# EAGLE design STM32F446RE_subcircuit (EAGLE 8.6.3)
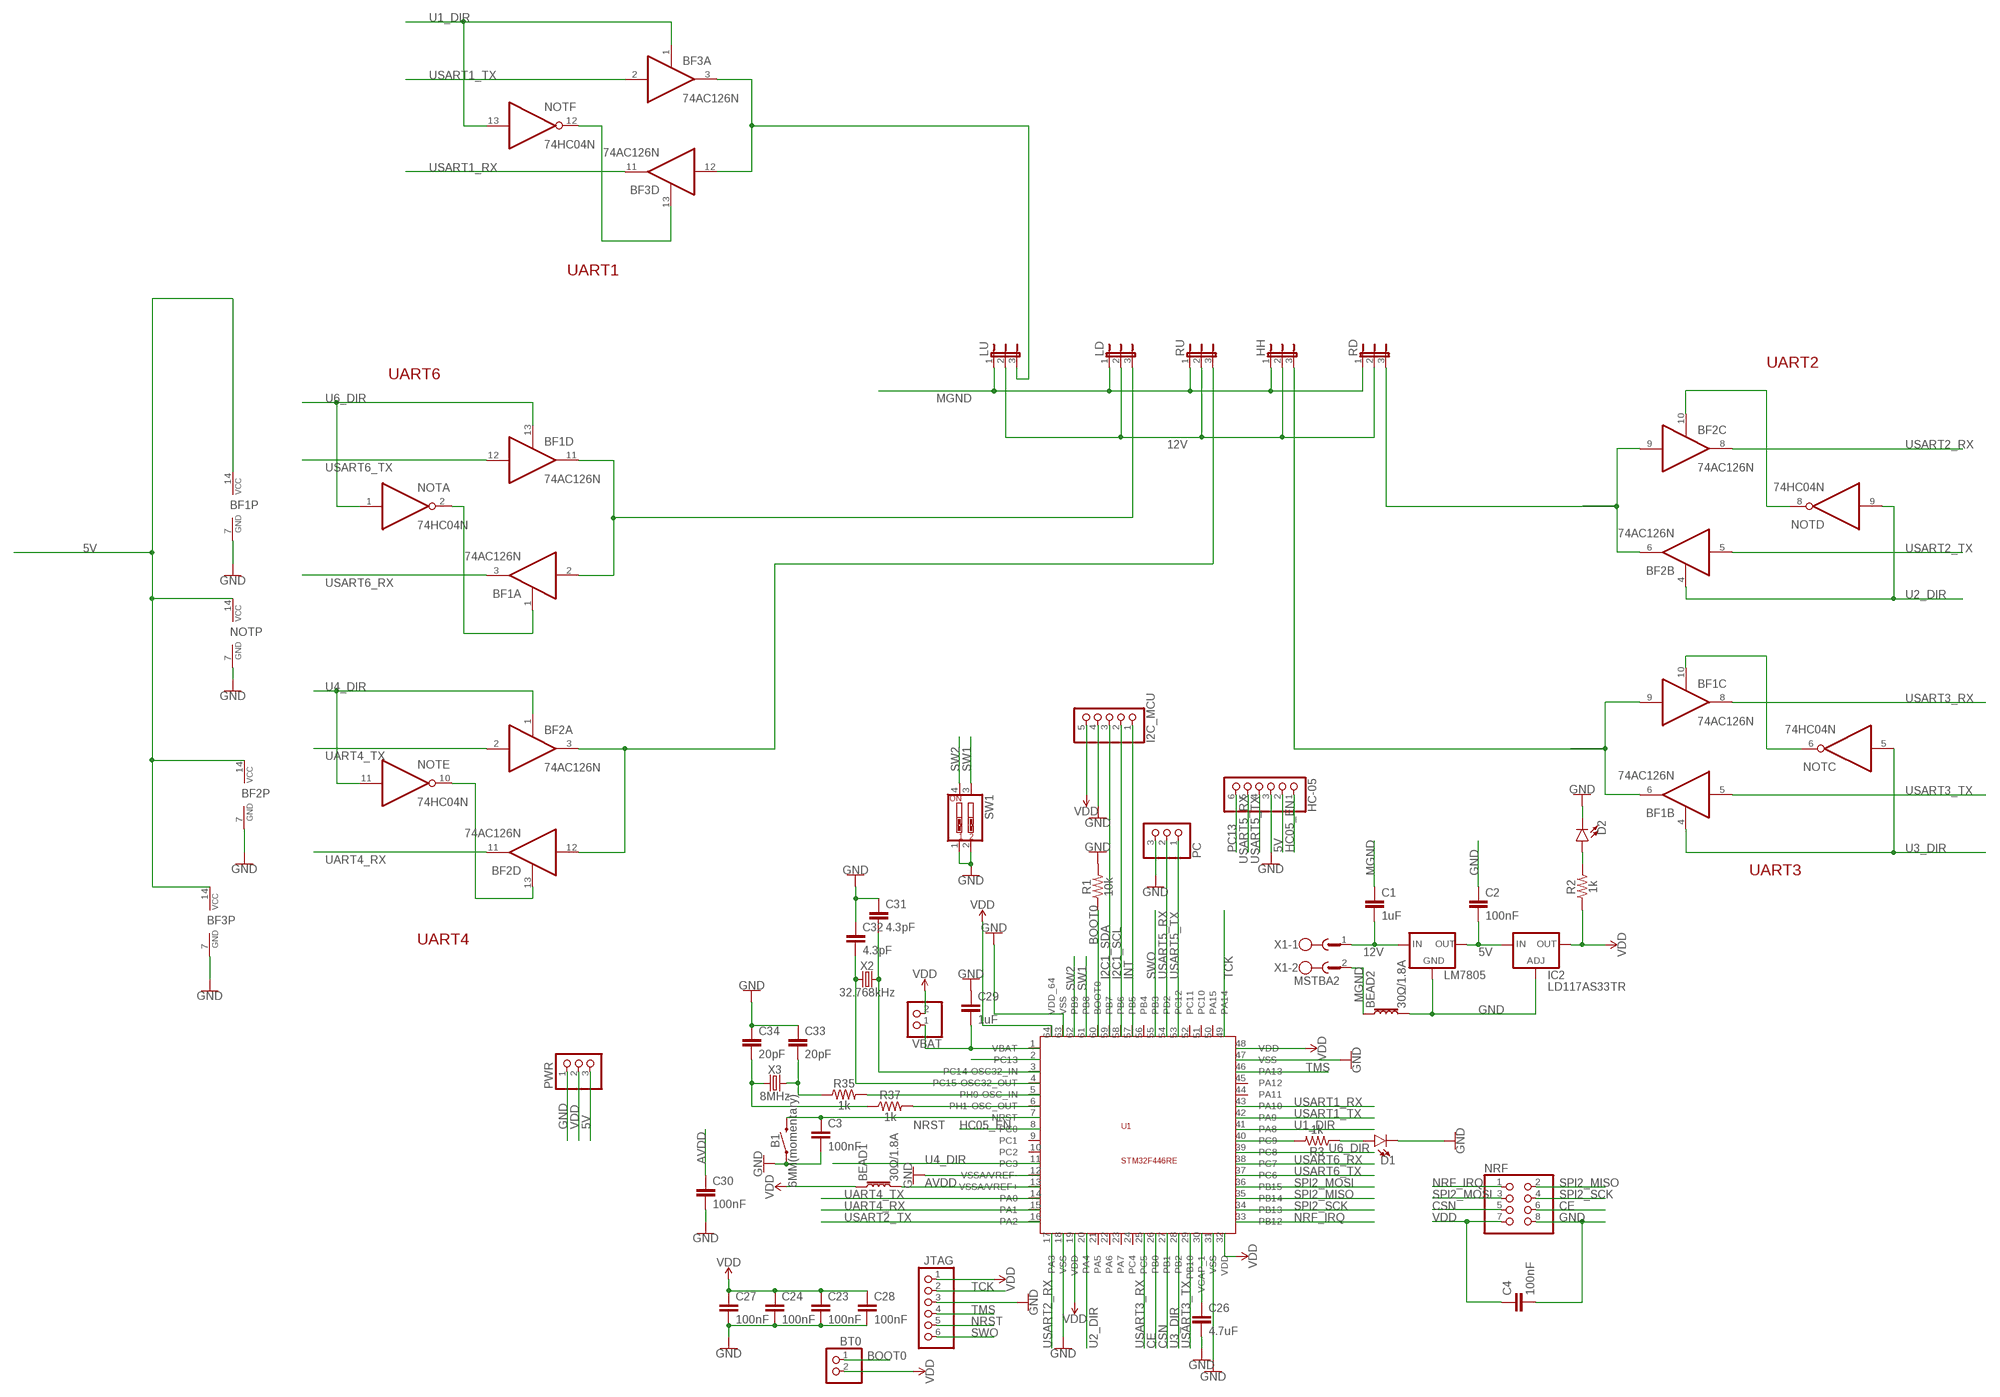
[diagram p0: schematic, sheet 1]

## Parts
B1  6MM(momentary)  MOMENTARY-SWITCH-SPST-PTH-6.0MM  [TACTILE_SWITCH_PTH_6.0MM]
BEAD1  30Ω/1.8A  FERRITE_BEAD-0603  [0603]
BEAD2  30Ω/1.8A  FERRITE_BEAD-0603  [0603]
BF1  74AC126N  [DIL14]
BF2  74AC126N  [DIL14]
BF3  74AC126N  [DIL14]
BT0  PINHD-1X2  [1X02]
C1  1uF  C5P  [C050-030-075]
C2  100nF  C2.5P  [C025-030X050]
C3  100nF  C2.5P  [C025-030X050]
C4  100nF  C2.5P  [C025-030X050]
C23  100nF  C2.5P  [C025-030X050]
C24  100nF  C2.5P  [C025-030X050]
C26  4.7uF  C5P  [C050-030-075]
C27  100nF  C2.5P  [C025-030X050]
C28  100nF  C2.5P  [C025-030X050]
C29  1uF  C5P  [C050-030-075]
C30  100nF  C2.5P  [C025-030X050]
C31  4.3pF  C2.5P  [C025-030X050]
C32  4.3pF  C2.5P  [C025-030X050]
C33  20pF  C2.5P  [C025-030X050]
C34  20pF  C2.5P  [C025-030X050]
D1  LED5MM  [LED_5MM]
D2  LED5MM  [LED_5MM]
HC-05  PINHD-1X6  [1X06]
HH  JP2E  [JP2]
I2C_MCU  PINHD-1X5  [1X05]
IC2  LD117AS33TR  [SOT223]
JTAG  PINHD-1X6  [1X06]
LD  JP2E  [JP2]
LM7805  V_REG_78XX-TO-220  [TO-220-ALT]
LU  JP2E  [JP2]
NOT  74HC04N  [DIL14]
NRF  PINHD-2X4  [2X04]
PC  PINHD-1X3  [1X03]
PWR  PINHD-1X3  [1X03]
R1  10k  10KOHM-HORIZ-1/4W-1%  [AXIAL-0.3]
R2  1k  1KOHM-HORIZ-1/4W-1%  [AXIAL-0.3]
R3  1k  1KOHM-HORIZ-1/4W-5%  [AXIAL-0.3]
R35  1k  10KOHM-HORIZ-1/4W-1%  [AXIAL-0.3]
R37  1k  10KOHM-HORIZ-1/4W-1%  [AXIAL-0.3]
RD  JP2E  [JP2]
RU  JP2E  [JP2]
SW1  SW_DIP-2  [EDG-02]
U1  STM32F446RE  [QFP50P1200X1200X160-64N]
VBAT  PINHD-1X2  [1X02]
X1  MSTBA2  [MSTBA2]
X2  32.768kHz  CRYSTAL-32.768KHZPTH-2X6  [CRYSTAL-PTH-2X6-CYL]
X3  8MHz  CRYSTAL-8MHZSMD-HC49UP  [HC49UP]

## Nets
5V: BF1.14(P:VCC) BF2.14(P:VCC) BF3.14(P:VCC) C2.2 HC-05.2 IC2.3(IN) LM7805.OUT NOT.14(P:VCC) PWR.3
12V: C1.2 HH.2 LD.2 LM7805.IN LU.2 RD.2 RU.2 X1.1
AVDD: BEAD1.2 C30.1 U1.13(VSSA/VREF+)
BOOT0: BT0.1 R1.P$1 U1.60(BOOT0)
CE: NRF.6 U1.26(PB0)
CSN: NRF.5 U1.27(PB1)
GND: B1.1 BEAD2.2 BF1.7(P:GND) BF2.7(P:GND) BF3.7(P:GND) C2.1 C3.2 C4.2 C23.2 C24.2 C26.2 C27.2 C28.2 C29.1 C30.2 C31.1 C32.1 C33.1 C34.1 D1.K(C) D2.K(C) HC-05.3 I2C_MCU.4 IC2.1(ADJ) JTAG.3 LM7805.GND NOT.7(P:GND) NRF.8 PC.3 PWR.1 R1.P$2 SW1.1 SW1.2 U1.12(VSSA/VREF-) U1.18(VSS) U1.31(VSS) U1.47(VSS) U1.63(VSS)
HC05_EN: HC-05.1 U1.8(PC0)
I2C1_SCL: I2C_MCU.2 U1.58(PB6)
I2C1_SDA: I2C_MCU.3 U1.59(PB7)
INT: I2C_MCU.1 U1.57(PB5)
MGND: BEAD2.1 C1.1 HH.1 LD.1 LU.1 RD.1 RU.1 X1.2
N$1: R35.P$2 U1.5(PH0-OSC_IN)
N$2: R37.P$2 U1.6(PH1-OSC_OUT)
N$3: BF1.1(A:OE) NOT.2(A:O)
N$4: C34.2 R37.P$1 X3.1
N$5: C33.2 R35.P$1 X3.2
N$6: BF1.10(C:OE) NOT.6(C:O)
N$7: D2.A R2.P$2
N$8: C31.2 U1.3(PC14-OSC32_IN) X2.2
N$9: C32.2 U1.4(PC15-OSC32_OUT) X2.1
N$10: R3.P$2 U1.40(PC9)
N$11: BF2.13(D:OE) NOT.10(E:O)
N$12: D1.A R3.P$1
N$17: BF2.10(C:OE) NOT.8(D:O)
N$18: BF3.13(D:OE) NOT.12(F:O)
N$20: BF3.3(A:O) BF3.12(D:I) LU.3
NRF_IRQ: NRF.1 U1.33(PB12)
NRST: B1.3 C3.1 JTAG.5 U1.7(NRST)
OUT1: BF1.2(A:I) BF1.11(D:O) LD.3
OUT2: BF2.3(A:O) BF2.12(D:I) RU.3
OUT3: BF1.6(B:O) BF1.9(C:I) HH.3
OUT4: BF2.6(B:O) BF2.9(C:I) RD.3
PC13: HC-05.6 U1.2(PC13)
SPI2_MISO: NRF.2 U1.35(PB14)
SPI2_MOSI: NRF.3 U1.36(PB15)
SPI2_SCK: NRF.4 U1.34(PB13)
SW1: SW1.3 U1.61(PB8)
SW2: SW1.4 U1.62(PB9)
SWO: JTAG.6 U1.55(PB3)
TCK: JTAG.2 U1.49(PA14)
TMS: JTAG.4 U1.46(PA13)
U1_DIR: BF3.1(A:OE) NOT.13(F:I) U1.41(PA8)
U2_DIR: BF2.4(B:OE) NOT.9(D:I) U1.20(PA4)
U3_DIR: BF1.4(B:OE) NOT.5(C:I) U1.28(PB2)
U4_DIR: BF2.1(A:OE) NOT.11(E:I) U1.11(PC3)
U6_DIR: BF1.13(D:OE) NOT.1(A:I) U1.39(PC8)
UART4_RX: BF2.11(D:O) U1.15(PA1)
UART4_TX: BF2.2(A:I) U1.14(PA0)
USART1_RX: BF3.11(D:O) U1.43(PA10)
USART1_TX: BF3.2(A:I) U1.42(PA9)
USART2_RX: BF2.8(C:O) U1.17(PA3)
USART2_TX: BF2.5(B:I) U1.16(PA2)
USART3_RX: BF1.8(C:O) U1.25(PC5)
USART3_TX: BF1.5(B:I) U1.29(PB10)
USART5_RX: HC-05.5 PC.2 U1.54(PD2)
USART5_TX: HC-05.4 PC.1 U1.53(PC12)
USART6_RX: BF1.3(A:O) U1.38(PC7)
USART6_TX: BF1.12(D:I) U1.37(PC6)
VBAT: C29.2 U1.1(VBAT) VBAT.1
VCAP_1: C26.1 U1.30(VCAP_1)
VDD: BEAD1.1 BT0.2 C4.1 C23.1 C24.1 C27.1 C28.1 I2C_MCU.5 IC2.4(OUT) JTAG.1 NRF.7 PWR.2 R2.P$1 U1.19(VDD) U1.32(VDD) U1.48(VDD) U1.64(VDD_64) VBAT.2
Unconnected: BF3.4(B:OE) BF3.5(B:I) BF3.6(B:O) BF3.8(C:O) BF3.9(C:I) BF3.10(C:OE) NOT.3(B:I) NOT.4(B:O) U1.9(PC1) U1.10(PC2) U1.21(PA5) U1.22(PA6) U1.23(PA7) U1.24(PC4) U1.44(PA11) U1.45(PA12) U1.50(PA15) U1.51(PC10) U1.52(PC11) U1.56(PB4)

## Notes on the sheet
- UART1
- UART6 | UART2
- UART3
- UART4

## Library data of the parts
B1 = SparkFun-Switches:MOMENTARY-SWITCH-SPST: Momentary Switch (Pushbutton) - SPST Normally-open (NO) SPST momentary switches (buttons, pushbuttons). Variants PTH-12MM - 12mm square, through-hole Momentary Pushbutton Switch - 12mm Square <https://www.sparkfun.com/products/9190> (COM-09190) PTH-6.0MM, PTH-6.0MM-KIT - 6.0mm square, through-hole Mini Pushbutton Switch <https://www.sparkfun.com/products/97> (COM-00097) KIT package intended for soldering kit's - only one side of pads' copper is exposed. PTH-RIGHT-ANGLE-KIT - Right-angle, through-hole Right Angle Tactile Button <https://www.sparkfun.com/products/10791> - Used on SparkFun BigTime Watch Kit <https://www.sparkfun.com/products/11734> SMD-12MM - 12mm square, surface-mount Tactile Button - SMD (12mm) <https://www.sparkfun.com/products/12993> (COM-12993) Used on SparkFun PicoBoard <https://www.sparkfun.com/products/11888> SMD-4.5MM - 4.5mm Square Trackball Switch Used on SparkFun Blackberry Trackballer Breakout <https://www.sparkfun.com/products/13169> SMD-4.6MMX2.8MM - 4.60mm x 2.80mm, surface mount Used on SparkFun SAMD21 Mini Breakout <https://www.sparkfun.com/products/13664> SMD-5.2MM, SMD-5.2-REDUNDANT - 5.2mm square, surface-mount Mini Pushbutton Switch - SMD <https://www.sparkfun.com/products/8720> (COM-08720) Used on Arduino Pro Mini <https://www.sparkfun.com/products/11114> REDUNDANT package connects both switch circuits together SMD-6.0X3.5MM - 6.0 x 3.5mm, surface mount Momentary Reset Switch SMD <https://www.sparkfun.com/products/8229> (COM-08229) SMD-6.2MM-TALL - 6.2mm square, surface mount Tactile Button - SMD (6mm) <https://www.sparkfun.com/products/12992> Used on SparkFun Digital Sandbox <https://www.sparkfun.com/products/12651> SMD-RIGHT-ANGLE - Right-angle, surface mount Used on SparkFun Block for Intel® Edison - Arduino <https://www.sparkfun.com/products/13036>; PROD_ID: SWCH-08441; SF_SKU: COM-00097
BEAD1 BEAD2 = SparkFun-Coils:FERRITE_BEAD: Ferrite Bead (blocks, cores, rings, chokes, etc.) Inductor with layers of ferrite used to suppress high frequencies. Often used to isolate high frequency noise. SparkFun Products: IOIO-OTG - V2.2 <https://www.sparkfun.com/products/13613> SparkFun SAMD21 Mini Breakout <https://www.sparkfun.com/products/13664> SparkFun 6 Degrees of Freedom Breakout - LSM6DS3 <https://www.sparkfun.com/products/13339> SparkFun SAMD21 Dev Breakout <https://www.sparkfun.com/products/13672>; PROD_ID: NDUC-13805
BF1-BF3 = 74xx-eu:74*126: Quad bus BUFFER, 3-state
BT0 VBAT = pinhead:PINHD-1X2: PIN HEADER
C1-C4 C23 C24 C26-C34 = ee2parts:C: Capacitor
D1 D2 = SparkFun-LED:LED: LED (Generic) Standard schematic elements and footprints for 5mm, 3mm, 1206, and 0603 sized LEDs. Generic LEDs with no color specified.
HC-05 JTAG = pinhead:PINHD-1X6: PIN HEADER
HH LD LU RD RU = jumper:JP2E: JUMPER
I2C_MCU = pinhead:PINHD-1X5: PIN HEADER
IC2 = v-reg:LD117A?*: Low drop fixed and adjustable positive voltage regulators 1 A Source: http://www.st.com/stonline/products/literature/ds/7194/ld1117axx.pdf
LM7805 = SparkFun-IC-Power:V_REG_78XX: Voltage Regulator Standard 78xx regulator. IGO (Input Ground Output). Spark Fun Electronics SKU : COM-00107; PROD_ID: VREG-08450; SF_ID: COM-00107
NOT = 74xx-eu:74*04: Hex INVERTER
NRF = pinhead:PINHD-2X4: PIN HEADER
PC PWR = pinhead:PINHD-1X3: PIN HEADER
R1 = SparkFun-Resistors:10KOHM: 10kΩ resistor A resistor is a passive two-terminal electrical component that implements electrical resistance as a circuit element. Resistors act to reduce current flow, and, at the same time, act to lower voltage levels within circuits. - Wikipedia; PROD_ID: RES-12183
R2 = SparkFun-Resistors:1KOHM: 1kΩ resistor A resistor is a passive two-terminal electrical component that implements electrical resistance as a circuit element. Resistors act to reduce current flow, and, at the same time, act to lower voltage levels within circuits. - Wikipedia; PROD_ID: RES-12182
R3 = SparkFun-Resistors:1KOHM: 1kΩ resistor A resistor is a passive two-terminal electrical component that implements electrical resistance as a circuit element. Resistors act to reduce current flow, and, at the same time, act to lower voltage levels within circuits. - Wikipedia; PROD_ID: RES-08380
R35 R37 = SparkFun-Resistors:10KOHM: 10kΩ resistor A resistor is a passive two-terminal electrical component that implements electrical resistance as a circuit element. Resistors act to reduce current flow, and, at the same time, act to lower voltage levels within circuits. - Wikipedia; PROD_ID: RES-12183; VALUE: 10k
SW1 = special:SW_DIP-2: DIP SWITCH
U1 = STM32F446RE:STM32F446RE
X1 = con-phoenix-508:MSTBA2: PHOENIX; MF: FARNELL; MPN: 1757242; OC_FARNELL: 3705171; OC_NEWARK: 71C4161
X2 = SparkFun-Clocks:CRYSTAL-32.768KHZ: 32.768kHz Crystal Frequency: 32.768kHz Frequency Stability: ±20ppm Load Capacitance: 12.5pF (PTH-2X6 & SMD-3.2X1.5), 6pF (SMD-2X6) SparkFun Products: SparkFun BigTime Watch Kit <https://www.sparkfun.com/products/11734> SparkFun nRF52832 Breakout <https://www.sparkfun.com/products/13990> SparkFun Real Time Clock Module <https://www.sparkfun.com/products/12708>; PROD_ID: XTAL-10112
X3 = SparkFun-Clocks:CRYSTAL-8MHZ: 8MHz Crystal Datasheet Example <http://www.futureelectronics.com/en/technologies/electromechanical/timing-devices/crystals/Pages/6008189-ABM3B-8.000MHZ-B2-T.aspx?IM=0> Frequency: 8MHz Frequency Tolerance: ±20ppm Load Capacitance: 18pF SparkFun Products: Pro Micro -3.3V/8MHz <https://www.sparkfun.com/products/12587> WAV Trigger <https://www.sparkfun.com/products/13660>; PROD_ID: XTAL-11706

## Net classes
0 default: width 0.178 mm, drill 0.178 mm, clearance 0.178 mm

## Board
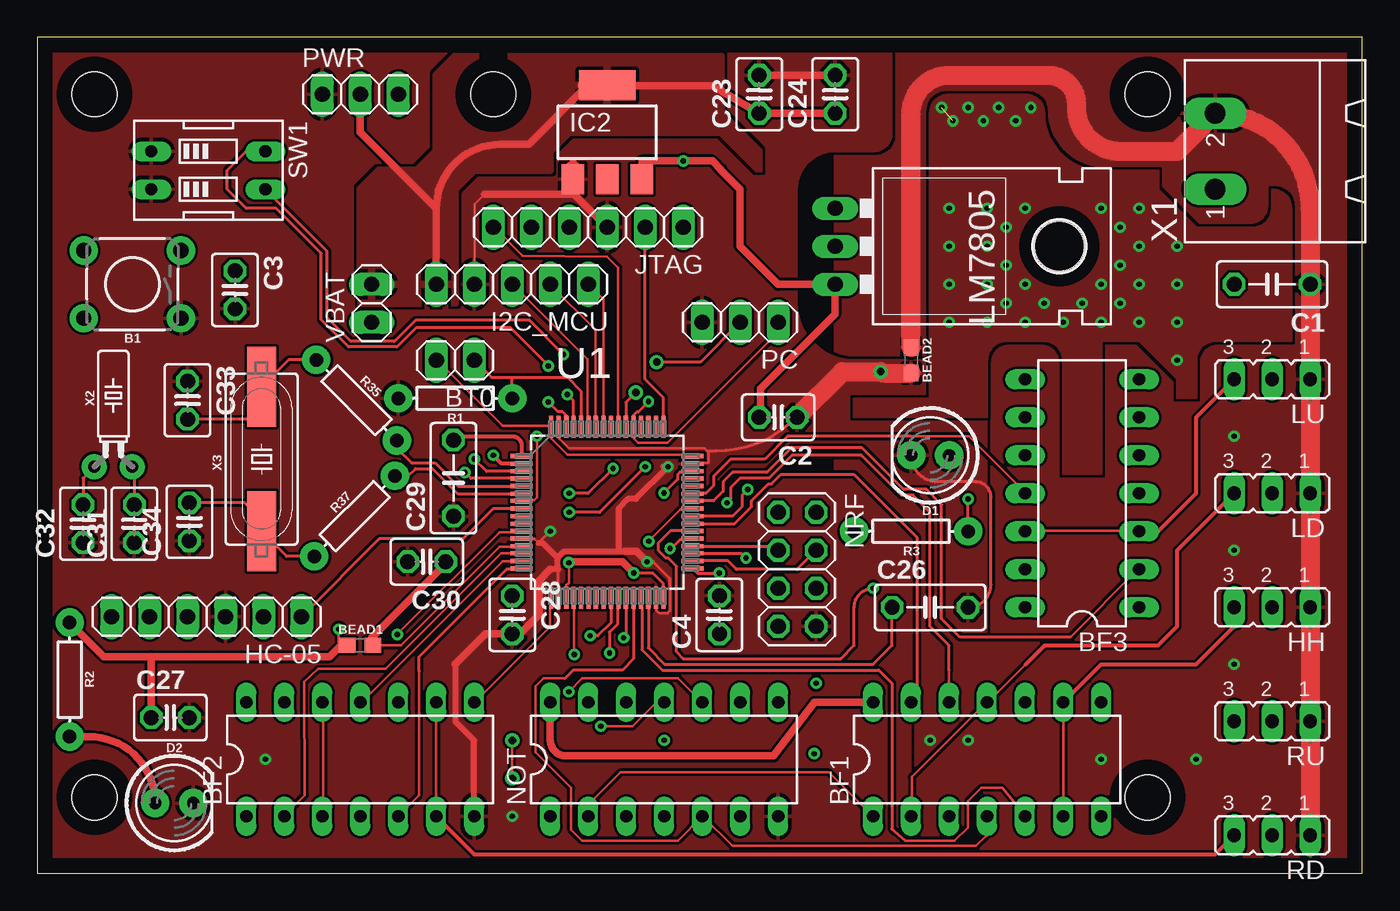
[diagram p1: board, top side]
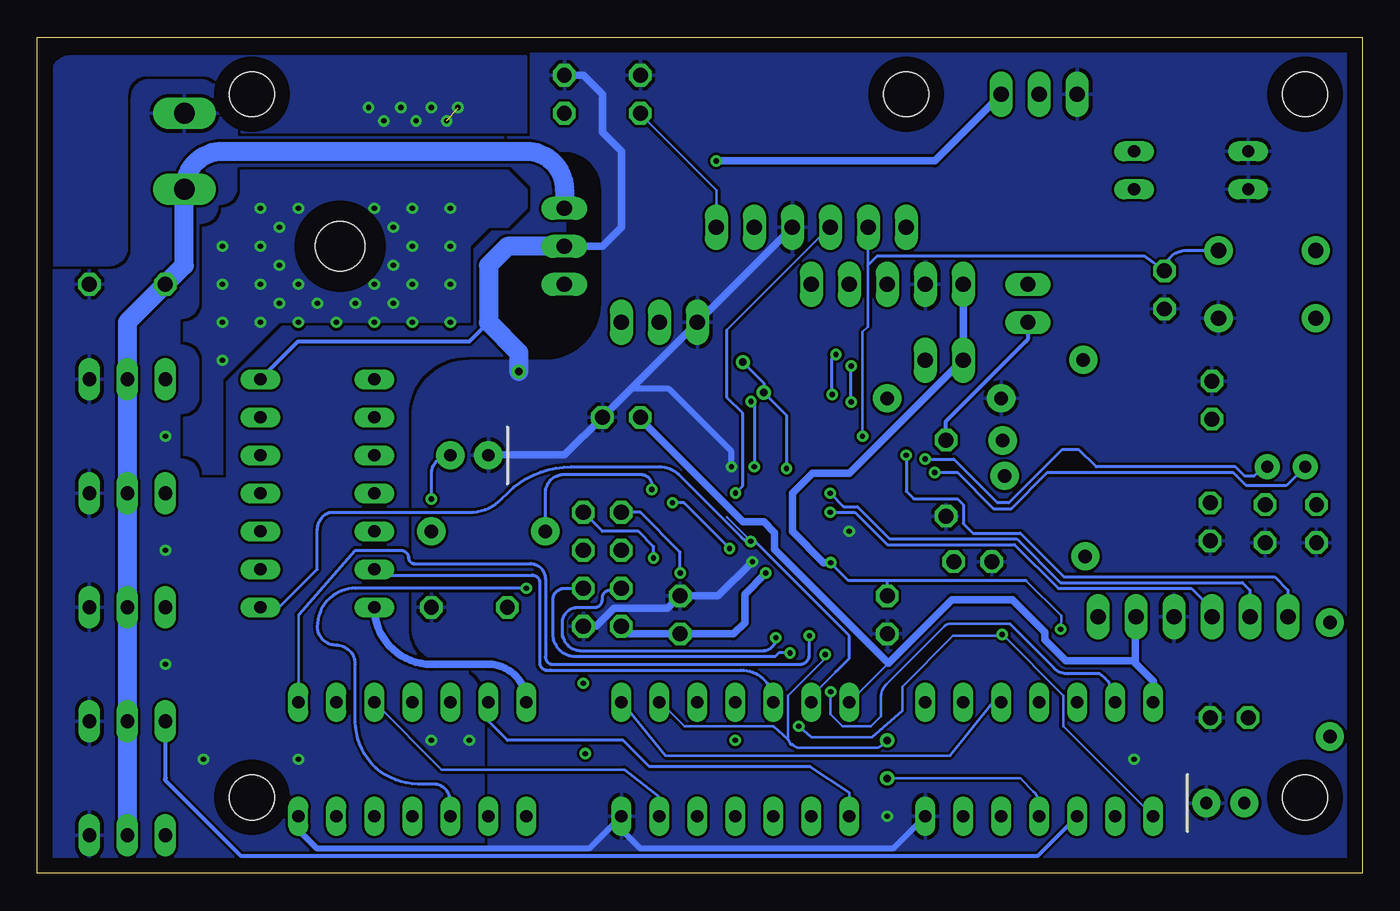
[diagram p2: board, bottom side, seen from below]

Size 88.57 x 55.87 mm. Coordinates in mm from the lower left corner, seen from the top.
Outline: 0,0 88.57,0 88.57,55.87 0,55.87 0,0
Copper layers (1*16): Top 0.035mm / dielectric 1.5mm / Bottom 0.035mm
Design rules "default *": minimum track width 1mil, minimum drill 0.35mm, track to track 6mil, track to pad 6mil, pad to pad 6mil, via to via 6mil, smd to smd 6mil, copper to edge 40mil, drill to drill 6mil, minimum pad ring 10mil, minimum via ring 8mil, stop-mask expansion 4mil, vias tented up to drill 0mil, thermal gap 10mil
Holes 3 mm at 74.23,5.08 3.81,5.08 3.81,52.07 74.23,52.07 30.48,52.07

### Footprints (pad centres in the part's own frame; a part is rotated, then mirrored left to right if it is on the bottom)
TACTILE_SWITCH_PTH_6.0MM = drill 1.016 pad 1.88: 1 -3.251,2.261; 2 3.251,2.261; 3 -3.251,-2.261; 4 3.251,-2.261
0603 = smd 1.1 x 1: 1 -0.85,0; 2 0.85,0
DIL14 = drill 0.813 long: 1 -7.62,-3.81; 2 -5.08,-3.81; 3 -2.54,-3.81; 4 0,-3.81; 5 2.54,-3.81; 6 5.08,-3.81; 7 7.62,-3.81; 8 7.62,3.81; 9 5.08,3.81; 10 2.54,3.81; 11 0,3.81; 12 -2.54,3.81; 13 -5.08,3.81; 14 -7.62,3.81
1X02 = drill 1.016 long: 1 -1.27,0; 2 1.27,0
C050-030-075 = drill 1 octagon: 1 -2.54,0; 2 2.54,0
C025-030X050 = drill 1 octagon: 1 -1.27,0; 2 1.27,0
LED_5MM = drill 0.813 pad 1.88: A -1.27,0; K 1.27,0
1X06 = drill 1.016 long: 1 -6.35,0; 2 -3.81,0; 3 -1.27,0; 4 1.27,0; 5 3.81,0; 6 6.35,0
JP2 = drill 0.914 long: 1 -2.54,0; 2 0,0; 3 2.54,0
1X05 = drill 1.016 long: 1 -5.08,0; 2 -2.54,0; 3 0,0; 4 2.54,0; 5 5.08,0
SOT223 = smd 1.5 x 2: 1 -2.3,-3.15; 2 0,-3.15; 3 2.3,-3.15 | smd 3.8 x 2: 4 0,3.15
TO-220-ALT = drill 1.016 long: GND 0,-3.81; IN -2.54,-3.81; OUT 2.54,-3.81 | hole 3.302: 0,11.176
2X04 = drill 1.016 octagon: 1 -3.81,-1.27; 2 -3.81,1.27; 3 -1.27,-1.27; 4 -1.27,1.27; 5 1.27,-1.27; 6 1.27,1.27; 7 3.81,-1.27; 8 3.81,1.27
1X03 = drill 1.016 long: 1 -2.54,0; 2 0,0; 3 2.54,0
AXIAL-0.3 = drill 0.9 pad 1.88: P$1 -3.81,0; P$2 3.81,0
EDG-02 = drill 0.813 long: 1 -1.27,-3.81; 2 1.27,-3.81; 3 1.27,3.81; 4 -1.27,3.81
QFP50P1200X1200X160-64N = smd 1.473 x 0.279: 1 -5.715,3.759; 2 -5.715,3.251; 3 -5.715,2.743; 4 -5.715,2.261; 5 -5.715,1.753; 6 -5.715,1.245; 7 -5.715,0.762; 8 -5.715,0.254; 9 -5.715,-0.254; 10 -5.715,-0.762; 11 -5.715,-1.245; 12 -5.715,-1.753; 13 -5.715,-2.261; 14 -5.715,-2.743; 15 -5.715,-3.251; 16 -5.715,-3.759; 33 5.715,-3.759; 34 5.715,-3.251; 35 5.715,-2.743; 36 5.715,-2.261; 37 5.715,-1.753; 38 5.715,-1.245; 39 5.715,-0.762; 40 5.715,-0.254; 41 5.715,0.254; 42 5.715,0.762; 43 5.715,1.245; 44 5.715,1.753; 45 5.715,2.261; 46 5.715,2.743; 47 5.715,3.251; 48 5.715,3.759 | smd 0.279 x 1.473: 17 -3.759,-5.715; 18 -3.251,-5.715; 19 -2.743,-5.715; 20 -2.261,-5.715; 21 -1.753,-5.715; 22 -1.245,-5.715; 23 -0.762,-5.715; 24 -0.254,-5.715; 25 0.254,-5.715; 26 0.762,-5.715; 27 1.245,-5.715; 28 1.753,-5.715; 29 2.261,-5.715; 30 2.743,-5.715; 31 3.251,-5.715; 32 3.759,-5.715; 49 3.759,5.715; 50 3.251,5.715; 51 2.743,5.715; 52 2.261,5.715; 53 1.753,5.715; 54 1.245,5.715; 55 0.762,5.715; 56 0.254,5.715; 57 -0.254,5.715; 58 -0.762,5.715; 59 -1.245,5.715; 60 -1.753,5.715; 61 -2.261,5.715; 62 -2.743,5.715; 63 -3.251,5.715; 64 -3.759,5.715
MSTBA2 = drill 1.397 long: 1 -2.54,5.08; 2 2.54,5.08
CRYSTAL-PTH-2X6-CYL = drill 0.813 pad 1.676: 1 -1.27,0; 2 1.27,0
HC49UP = smd 5.334 x 1.93: 1 -4.826,0; 2 4.826,0

### Placement (x,y rotation side)
B1  6.35,39.37 180 top
BEAD1  21.59,15.24 0 top
BEAD2  58.42,34.29 270 top
BF1  63.5,7.62 0 top
BF2  21.59,7.62 0 top
BF3  69.85,25.4 90 top
BT0  27.94,34.29 180 top
C1  82.55,39.37 180 top
C2  49.53,30.48 180 top
C3  13.21,38.99 270 top
C4  45.59,17.27 90 top
C23  48.26,52.07 90 top
C24  53.34,52.07 90 top
C26  59.69,17.78 0 top
C27  8.89,10.41 0 top
C28  31.75,17.27 270 top
C29  27.81,26.42 90 top
C30  26.04,20.83 180 top
C31  6.48,23.37 90 top
C32  3.05,23.37 90 top
C33  10.03,31.62 270 top
C34  10.16,23.49 90 top
D1  59.69,27.94 180 top
D2  9.14,4.7 0 top
HC-05  11.3,17.14 180 top
HH  82.55,17.78 180 top
I2C_MCU  31.75,39.37 180 top
IC2  38.1,49.53 0 top
JTAG  36.83,43.18 180 top
LD  82.55,25.4 180 top
LM7805  57.15,41.91 270 top
LU  82.55,33.02 180 top
NOT  41.91,7.62 0 top
NRF  50.8,20.32 270 top
PC  46.99,36.83 180 top
PWR  21.59,52.07 0 top
R1  27.94,31.75 180 top
R2  2.16,12.95 270 top
R3  58.42,22.86 180 top
R35  21.34,31.62 315 top
R37  21.21,23.88 45 top
RD  82.55,2.54 180 top
RU  82.55,10.16 180 top
SW1  11.43,46.99 270 top
U1  38.1,24.13 0 top
VBAT  22.35,38.1 90 top
X1  83.82,48.26 90 top
X2  5.08,27.18 0 top
X3  14.99,27.69 90 top

### Tracks (layer width: path | path; a pad name or v marks a point on that pad's centre or on a via)
5V  (via drill 0.35)
  Top 0.178: 53.31,39.43 LM7805.OUT 53.31,39.34 | 48.34,30.54 C2.2
  Top 0.508: 48.34,30.54 48.34,32.38 53.31,37.36 53.31,39.34 | BF1.14 51.94,11.43 49.22,7.85 35.33,7.85 arc-90 34.29,8.89 NOT.14 | LM7805.OUT 49.53,39.37 46.99,41.91 46.99,45.72 45.72,46.99 45.72,47.03 45.14,47.61 v43.18,47.61 40.42,47.61 IC2.3
  Bottom 0.178: 56.43,11.43 BF1.14 | 66.03,17.74 BF3.14 | 23.38,18.3 23.37,18.29 | NOT.14 31.67,14.05 | 48.07,30.45 48.25,30.45 C2.2
  Bottom 0.508: 23.38,18.3 27.42,18.3 31.67,14.05 39.29,21.67 39.29,22.78 40,23.49 41.4,23.49 48.25,30.34 48.25,30.45 | 15.18,14.03 15.37,14.22 19.81,14.22 21.21,15.62 21.21,16.13 23.37,18.29 | 15.18,14.03 13.97,12.83 BF2.14 | BF1.14 arc-90 58.42,13.97 62.23,13.97 arc90 BF3.14 | 15.18,14.03 15.18,17.08 HC-05.2 | PWR.3 28.57,47.62 43.17,47.62 v43.18,47.61
12V
  Top 0.254: 79.98,39.42 C1.2
  Bottom 0.254: 80.07,39.33 C1.2 | 82.47,33.02 LU.2
  Bottom 1.27: RD.2 RU.2 HH.2 LD.2 LU.2 82.55,36.83 C1.2 78.74,40.64 X1.1 arc90 76.2,48.26 55.88,48.26 arc90 53.34,45.72 LM7805.IN
AVDD
  Top 0.178: 22.2,15.25 22.38,15.25 BEAD1.2 22.47,15.25 24.33,15.25 30.91,21.83 32.33,21.83 U1.13
  Top 0.508: C30.1 27.3,20.7 22.35,15.75 22.38,15.72 22.38,15.25
BOOT0
  Top 0.178: 36.33,30.48 36.33,29.92 U1.60 | BT0.1 29.22,34.28
  Top 0.203: 29.21,35.18 BT0.1 30.35,33.15 31.75,33.15 | 36.32,30.49 36.33,30.48 | 31.75,33.15 35.43,33.15 36.35,32.23 U1.60 | R1.P$1 31.75,33.15
CE  (via drill 0.35)
  Top 0.203: U1.26 38.77,18.33 38.77,16.64 38.25,16.12 v38.25,14.73
  Bottom 0.203: v38.25,14.73 38.99,14.73 39.24,14.48 52.58,14.48 arc90 54.1,16 54.1,18.29 arc90 53.34,19.05 NRF.6
CSN  (via drill 0.35)
  Top 0.203: U1.27 39.34,15.9 arc-90 v39.2,15.75
  Bottom 0.203: v39.2,15.75 arc90 40.08,14.86 52.2,14.86 arc90 53.47,16.13 53.47,16.76 arc90 52.45,17.78 51.31,17.78 arc-90 50.8,18.29 50.8,18.41 arc90 50.29,18.92 49.66,18.92 arc-90 NRF.5
GND  (via drill 0.35, 0.5 pad 0.95)
  Top 0.178: 33.51,22.08 33.22,22.36 32.42,22.36 U1.12 | 34.82,20.32 34.82,18.45 U1.18 34.82,18.36 | 42.29,19.34 42.29,19.05 42.29,17.56 42.11,17.39 41.58,17.39 41.4,17.56 41.4,18.36 U1.31 | 35.8,45.48 35.85,45.43 35.8,45.39 | 29.91,45.39 29.22,44.7 29.22,39.43 I2C_MCU.4 29.13,39.34 | 58.47,27.88 D1.K | 50.82,30.54 C2.1 50.74,30.45 | U1.63 34.91,29.83 34.91,29.03 35.53,28.41 44.6,28.41 44.76,28.25 44.87,28.14 44.87,27.43 43.89,27.43 U1.47 43.8,27.43 | 48.34,53.39 C23.2 | 53.31,53.39 C24.2 53.4,53.39 | 53.4,41.57 53.4,41.83 LM7805.GND | 73.58,33.03 BF3.7
  Top 0.203: I2C_MCU.4 29.21,38.1 | 33.51,22.08 v34.29,22.86 | 42.29,19.05 42.28,19.06 42.28,19.72 41.17,20.83 v40.77,20.83 | 44.76,28.25 45.42,28.25 arc45 50.74,30.45 | C26.2 arc90 63.75,19.3 63.75,25.15 arc90 62.74,26.16 60.2,26.16 arc-90 D1.K
  Top 0.406: BF2.7 29.21,8.89 27.94,10.16 27.94,13.97 | 34.29,20.32 34.82,20.32 34.77,20.37 34.77,21.08 | 34.77,21.08 35.22,21.52 38.86,21.52 | 33.51,22.08 33.77,22.08 34.77,21.08 | 38.86,21.52 39.3,21.52 | 41.86,27.18 v42.16,27.18 40,25.02 39.5,25.02 38.86,24.38 38.86,21.52
  Top 0.508: 35.8,45.48 35.8,46.99 35.8,47.61 | JTAG.3 35.85,45.43 | 35.8,45.39 29.91,45.39 | 39.3,21.52 40.07,21.52 v40.77,20.83 | C23.2 53.35,53.34 53.4,53.39 | 34.29,20.32 33.53,19.56 33.53,17.27 32.26,16 C28.2 29.97,16 27.94,13.97
  Top 1.27: 50.82,30.54 53.81,33.53 v56.39,33.53 arc45 56.6,33.44 BEAD2.2 | IC2.1 35.8,46.99 arc-45 35.8,46.99
  Bottom 0.178: 48.96,3.78 49.49,3.78 NOT.7 49.58,3.78 | 29.22,3.78 BF2.7 | 58.38,27.96 D1.K
  Bottom 0.254: BF3.7 71.12,35.56 59.69,35.56 58.42,36.83 | I2C_MCU.4 29.21,38.1
  Bottom 0.406: NOT.7 51.69,1.65 69.85,1.65 71.12,2.92 BF1.7 | BF2.7 31.37,1.65 48.26,1.65 49.49,2.88 49.49,3.78 | v42.16,27.18 42.16,28.19 46.35,32.38 48.89,32.38
  Bottom 0.508: 58.38,27.96 53.31,27.96 C2.1 48.89,32.38 PC.3 JTAG.3 | LM7805.GND 50.8,41.91 49.53,43.18 49.53,48.26 50.8,49.53 50.8,52.07 52.07,53.34 C24.2 | NRF.8 51.22,16.51 50.02,17.7 46.43,17.7 C4.2 43.05,18.54 v40.77,20.83
  Bottom 1.27: LM7805.GND 57.15,41.91 58.42,40.64 58.42,36.83 56.39,34.8 v56.39,33.53
  other vias: 31.75,3.81 15.24,7.62
  pour Top (rank 2): 0,55.88 0,0 57.15,0 arc90 58.42,1.27 58.42,11.43 arc-90 60.96,13.97 arc90 63.5,16.51 63.5,30.48 arc90 59.69,34.29 54.61,34.29 arc-90 50.8,38.1 50.8,45.72 arc-90 53.34,48.26 55.88,48.26 arc90 57.15,49.53 57.15,55.88
  pour Bottom (rank 2): 0,55.88 0,0 57.15,0 arc90 58.42,1.27 58.42,11.43 arc-90 60.96,13.97 arc90 63.5,16.51 63.5,30.48 arc90 59.69,34.29 54.61,34.29 arc-90 50.8,38.1 50.8,45.72 arc-90 53.34,48.26 55.88,48.26 arc90 57.15,49.53 57.15,55.88
HC05_EN
  Top 0.203: U1.8 30.48,24.38 28.45,22.35 22.86,22.35 HC-05.1
HEAT  (via drill 0.35)  (1 unrouted)
  other vias: 60.96,44.45 60.96,41.91 60.96,39.37 60.96,36.83 63.5,36.83 64.77,38.1 68.58,36.83 69.85,38.1 67.31,38.1 66.04,36.83 66.04,39.37 63.5,39.37 64.77,40.64 63.5,41.91 64.77,43.18 66.04,44.45 63.5,44.45 73.66,44.45 71.12,44.45 72.39,43.18 73.66,41.91 72.39,40.64 71.12,39.37 73.66,39.37 76.2,39.37 76.2,41.91 76.2,36.83 76.2,34.29 73.66,36.83 72.39,38.1 71.12,36.83 66.42,51.18 65.41,50.29 64.26,51.18 63.25,50.29 62.23,51.18 61.21,50.29 60.45,51.18
  pour Top: 54.61,31.75 59.69,31.75 59.69,50.8 arc-90 60.96,52.07 66.04,52.07 arc-90 67.31,50.8 arc90 71.12,46.99 74.93,46.99 74.93,45.72 77.47,43.18 81.28,43.18 arc90 82.55,44.45 82.55,45.72 arc-90 83.82,44.45 83.82,35.56 78.74,35.56 arc90 77.47,34.29 77.47,31.75 76.2,31.75 76.2,33.02 73.66,35.56 71.12,35.56 71.12,26.67 68.58,26.67 68.58,34.29 arc90 67.31,35.56 64.77,35.56 arc90 63.5,34.29 63.5,30.48 54.61,30.48
  pour Bottom: 57.15,46.99 55.88,45.72 55.88,44.45 57.15,43.18 58.42,43.18 59.69,41.91 59.69,36.83 72.39,36.83 76.2,33.02 76.2,26.67 77.47,26.67 arc-90 78.74,27.94 78.74,30.48 arc-90 77.47,31.75 77.47,34.29 arc-90 78.74,35.56 78.74,36.83 arc-90 77.47,38.1 77.47,43.18 arc-90 76.2,44.45 arc-90 74.93,45.72 74.93,46.99
  pour Bottom: 55.88,49.53 55.88,54.61 86.36,54.61 arc-90 87.63,53.34 87.63,40.64 83.82,40.64 arc-90 82.55,41.91 82.55,52.07 arc90 81.28,53.34 77.47,53.34 arc90 76.2,52.07 arc-90 74.93,50.8 74.93,49.53
I2C1_SCL
  Top 0.178: U1.58 37.31,29.92 37.31,36.32 34.29,39.34 I2C_MCU.2
I2C1_SDA
  Top 0.178: U1.59 36.78,29.92 36.78,34.37 31.8,39.34 I2C_MCU.3
INT
  Top 0.178: U1.57 37.85,38.37 36.87,39.34 I2C_MCU.1
MGND  (via drill 0.35)
  Top 0.254: 85.14,2.62 RD.1 | 85.14,10.08 RU.1 85.14,10.26 | 85.14,17.73 HH.1 85.14,17.82 | 85.05,33.02 LU.1 85.14,32.93 | 85.14,25.46 LD.1 85.14,25.29 | 85.05,39.33 C1.1 84.96,39.42 | 77.5,50.72 X1.2
  Top 1.27: RD.1 RU.1 HH.1 LD.1 LU.1 C1.1 85.09,44.45 arc90 X1.2 76.2,48.26 72.39,48.26 arc-90 69.47,51.18 69.47,51.43 arc90 67.56,53.34 60.96,53.34 arc90 58.42,50.8 BEAD2.1
  other vias: 59.69,8.89 62.23,8.89 71.12,7.62 77.47,7.62 80.01,13.97 80.01,21.59 80.01,29.21
  pour Top (rank 6): 53.34,55.88 53.34,0 88.9,0 88.9,55.88
  pour Bottom (rank 6): 53.34,55.88 53.34,0 88.9,0 88.9,55.88
N$1
  Top 0.178: 32.33,25.92 U1.5
  Top 0.203: R35.P$2 24.03,28.42 25.02,27.43 26.57,27.43 28.12,25.88 U1.5
N$2
  Top 0.203: U1.6 28.09,25.38 26.42,27.05 25.27,27.05 24.79,26.57 R37.P$2
N$3
  Top 0.178: NOT.2 36.87,3.87 36.89,4.63 39,6.74 52.93,6.74 55.8,3.87 BF1.1
N$4
  Top 0.203: R37.P$1 16.66,21.18 X3.1 14.99,23.62 13.84,24.77 C34.2
N$5
  Top 0.203: R35.P$1 16.79,34.32 X3.2 14.99,31.37 13.97,30.35 C33.2
N$6
  Bottom 0.178: NOT.6 47,3.87 47.03,5.14 49.33,6.93 61.53,6.93 66.03,11.43 BF1.10
N$7
  Top 0.508: R2.P$2 3.43,9.14 arc-90 D2.A
N$8  (via drill 0.35)
  Top 0.178: 32.33,26.9 U1.3
  Top 0.203: U1.3 30.02,26.87 v29.21,27.69 | X2.2 6.48,27.05 C31.2
  Bottom 0.203: v29.21,27.69 27.3,27.69 24.38,24.77 23.62,24.77 20.07,28.32 18.94,28.32 17.78,27.16 8.46,27.16 7.84,26.54 7.24,26.54 6.6,27.18 X2.2
N$9  (via drill 0.35)
  Top 0.178: 32.33,26.45 U1.4
  Top 0.203: U1.4 28.98,26.39 v28.57,26.8 | X2.1 3.05,26.42 C32.2
  Bottom 0.203: v28.57,26.8 27.05,26.8 24.64,24.38 23.46,24.38 21.07,26.78 8.62,26.78 7.75,25.91 5.08,25.91 X2.1
N$10  (via drill 0.35)
  Top 0.203: v47.5,25.65 47.12,25.27 47.12,24.51 46.48,23.88 U1.40
  Bottom 0.203: R3.P$2 54.61,25.4 arc90 53.34,26.67 48.26,26.67 arc106 v47.5,25.65
N$11  (via drill 0.35)
  Top 0.178: v35.53,12.14 36.42,13.03 42.82,13.03 44.42,11.43 NOT.10
  Bottom 0.178: v35.53,12.14 35.53,10.63 34.73,9.83 32.83,9.83 32.17,10.49 32.17,11.76 arc45 31.8,12.65 27.94,16.51 arc45 27.54,16.67 23.56,16.67
  Bottom 0.203: BF2.13 arc-52 17.53,13.33 19.69,13.33 arc45 20.59,13.71 23.56,16.67
N$12  (via drill 0.35)
  Top 0.203: R3.P$1 v62.23,25.02
  Bottom 0.203: v62.23,25.02 62.23,26.67 arc90 D1.A
N$17
  Bottom 0.178: BF2.10 24.69,11.43 27.56,7.87 46.57,7.87 49.49,11.43 NOT.8
N$18
  Bottom 0.178: 39.89,11.43 NOT.12
  Bottom 0.203: BF3.13 arc-90 65.66,19.94 55.5,19.94 arc90 54.99,19.43 54.99,13.97 arc-90 54.23,13.59 41.53,13.59 arc90 NOT.12
N$20
  Top 0.178: BF3.12 66.12,22.9 73.58,22.9 BF3.3 73.67,22.9 | 79.98,33.02 LU.3
  Top 0.254: BF3.3 74.93,22.86 77.47,25.4 77.47,30.48 LU.3
N$57  (via drill 0.35)
  other vias: 41.91,8.89
N$58  (via drill 0.35)
  other vias: 52.07,12.7
N$59  (via drill 0.35)
  other vias: 51.94,8
NRF_IRQ  (via drill 0.35)
  Top 0.203: U1.33 44.12,20.07 v45.59,20.07
  Bottom 0.203: v45.59,20.07 45.59,21.46 48.26,24.13 NRF.1
NRST  (via drill 0.35)
  Top 0.178: v33.4,29.21 33.4,25.12 33.22,24.94 32.42,24.94 U1.7
  Bottom 0.178: v33.4,29.21 33.4,36.18 33.04,36.54 33.04,40.64 33.04,43.17 JTAG.5 32.96,43.26
  Bottom 0.203: 33.04,40.64 32.41,41.27 14.61,41.27 C3.1 arc90 11.71,41.63 B1.3
OUT1
  Top 0.178: BF1.2 58.47,3.87 58.47,6.45 63.45,11.43 BF1.11 63.54,11.43 66.06,13.95 66.38,14.28 | 79.45,25.38 79.98,25.38 LD.3
  Top 0.254: 66.06,13.95 67.35,15.24 74.93,15.24 76.2,16.51 76.2,21.59 79.98,25.38
OUT2
  Top 0.178: BF2.3 19.09,3.87 19.09,11.43 BF2.12
  Bottom 0.178: 79.98,10.08 RU.3 | 19.09,3.78 BF2.3
  Bottom 0.254: 79.98,10.08 79.98,6.37 80.01,6.35 80.01,6.22 74.93,1.14 21.72,1.14 BF2.3
OUT3
  Top 0.178: BF1.6 68.61,3.87 68.61,11.43 BF1.9 | 79.98,17.73 HH.3
  Top 0.254: BF1.9 71.12,13.97 77.47,13.97 80.01,16.51 HH.3
OUT4
  Top 0.178: BF2.9 26.64,11.43 26.64,3.87 BF2.6 26.73,3.78 | 79.98,2.62 RD.3
  Top 0.254: BF2.6 29.21,1.27 78.74,1.27 RD.3
PC13  (via drill 0.35)
  Top 0.254: U1.2 31.04,27.38 v30.48,27.94
  Bottom 0.203: v30.48,27.94 30.48,25.53 29.97,25.02 27.05,25.02 26.67,24.64 26.67,23.37 26.04,22.73 22.86,22.73 19.94,19.81 5.84,19.81 4.95,18.92 HC-05.6
SPI2_MISO  (via drill 0.35)
  Top 0.203: U1.35 47.07,21.39 v47.37,21.08
  Bottom 0.203: v47.37,21.08 47.37,21.84 48.39,22.86 50.8,22.86 NRF.2
SPI2_MOSI
  Top 0.203: U1.36 49.25,21.87 NRF.3
SPI2_SCK
  Top 0.203: NRF.4 50.8,20.32 46.74,20.32 46.18,20.88 U1.34
SW1  (via drill 0.35)
  Top 0.203: U1.61 35.84,31.6 v35.43,32 | v35.18,34.67 32.89,36.96 25.27,36.96 23.88,35.56 20.96,35.56 19.37,37.15 19.37,41.59 SW1.3
  Bottom 0.203: v35.43,32 35.43,34.42 v35.18,34.67
SW2  (via drill 0.35)
  Top 0.203: v34.16,31.5 34.8,30.86 35.1,30.86 35.36,30.61 U1.62 | v34.16,33.91 31.62,36.45 25.3,36.45 24.03,35.18 20.8,35.18 18.99,36.99 18.99,41.43 15.97,44.45 13.97,44.45 12.7,45.72 12.7,46.99 13.97,48.26 SW1.4
  Bottom 0.203: v34.16,31.5 v34.16,33.91
SWO
  Top 0.178: U1.55 38.82,29.92 38.82,40.49 38.1,41.21 32.45,41.27 30.56,43.17 JTAG.6
TCK
  Top 0.178: 41.85,29.92 U1.49
  Top 0.2: JTAG.2 40.69,43.17 40.64,43.12 40.64,33.02 41.86,31.8 U1.49
TMS  (via drill 0.35)
  Top 0.178: 43.8,26.81 U1.46
  Top 0.203: U1.46 43.75,26.81 42.96,26.81 42.8,26.65 42.8,26.33 v41.89,25.42
  Bottom 0.178: 42.47,36.32 35.62,43.17 JTAG.4
  Bottom 0.203: v41.89,25.42 41.4,25.91 41.4,30.73 42.47,31.8 42.47,36.32
U1_DIR  (via drill 0.35)
  Top 0.178: v40.87,22.19 43,24.32 43.8,24.32 U1.41
  Bottom 0.178: 35.18,13.47 36.78,11.87 36.78,11.43 NOT.13 | 73.05,17.83 73.58,17.83 BF3.1 | v40.87,22.19 42.47,23.79
  Bottom 0.203: BF3.1 72.39,17.78 69.85,20.32 69.85,22.96 arc45 69.47,23.88 arc45 68.86,24.13 59.69,24.13 arc-45 57.52,25.03 57.15,25.4 arc45 52.86,27.18 46.95,27.18 arc45 45.72,26.67 41.5,22.45 arc-45 v40.87,22.19 40.6,22.19 34.29,15.87 34.29,14.36 35.18,13.47
U2_DIR  (via drill 0.35, 0.5 pad 0.95)
  Top 0.178: v35.89,14.63 35.89,18.36 U1.20 | v31.75,6.35 v31.75,8.89
  Bottom 0.178: v35.89,14.63 35.89,14.36 38.38,11.87 38.38,10.36 38.4,8.95 38.19,8.61 38.1,8.61 arc-45 37.54,8.38 32.51,8.38 arc-43 v31.75,8.89 | 39.37,9.83 45.31,9.83 46.91,11.43 NOT.9 | BF2.4 21.59,4.55 arc-45 21.96,5.45 22.86,6.35 v31.75,6.35
  Bottom 0.203: 39.37,9.83 38.4,8.95
U3_DIR
  Top 0.178: 35.27,13.03 33.84,13.03 33.31,12.5 33.31,8.08 35.69,5.71 35.69,2.92 36.42,2.18 42.82,2.18 NOT.5 44.51,3.78 46.47,1.83 62.76,1.83 63.45,2.51 BF1.4 | 39.8,18.36 U1.28
  Top 0.203: 35.27,13.03 35.83,13.59 39.12,13.59 39.85,14.33 U1.28
U4_DIR  (via drill 0.35)
  Top 0.178: v24.07,15.96 30.91,22.81 32.33,22.81 U1.11 | NOT.11 41.4,11.43 39.8,9.83 v37.67,9.83
  Bottom 0.178: BF2.1 14.02,3.87 19.98,9.83 19.98,11.87 v24.07,15.96 24.07,15.87 27.36,15.87 30.75,12.48 30.75,10.87 32.78,9.09 36.82,9.09 37.59,9.78 v37.67,9.83
U6_DIR
  Top 0.203: U1.39 46.61,23.37 47.75,24.51 47.75,24.89 48.89,26.03 49.08,26.03 49.72,26.67 54.61,26.67 58.8,22.48 58.8,11.81 BF1.13
  Bottom 0.178: 58.38,11.43 BF1.13 | 36.91,7.14 34.28,5.4 34.29,3.87 NOT.1
  Bottom 0.203: 36.91,7.14 47.65,7.14 49.4,8.89 57.15,8.89 58.42,10.16 BF1.13
UART4_RX
  Top 0.178: U1.15 32.33,20.85 31.09,20.85 21.67,11.43 BF2.11
UART4_TX
  Top 0.178: U1.14 31,21.39 23.28,13.67 18.77,13.67 17.84,12.79 17.87,5.23 16.51,3.87 BF2.2
USART1_RX
  Top 0.178: 57.94,29.21 58.42,29.21 62.29,29.21 66.03,25.48 BF3.11 | 43.89,25.39 U1.43
  Top 0.203: 43.89,25.39 44.69,25.39 45.21,25.91 45.21,26.54 46.35,27.69 48.64,27.69 50.16,29.21 58.42,29.21
USART1_TX
  Top 0.178: 69.05,15.79 73.58,20.32 BF3.2 | 43.89,24.85 U1.42
  Top 0.203: 69.05,15.79 61.68,15.79 60.45,17.02 60.45,24.64 59.44,25.65 57.91,25.65 55.12,28.45 50.42,28.45 48.77,26.8 46.48,26.8 45.85,26.16 45.85,25.53 45.21,24.89 U1.42
USART2_RX
  Top 0.178: U1.17 34.29,18.36 34.29,16.5 29.22,11.43 BF2.8
USART2_TX
  Top 0.178: 32.33,20.34 32.33,20.32 U1.16 | 25.51,13.53 25.51,5.23 24.16,3.87 BF2.5
  Top 0.203: 25.51,13.53 25.53,13.54 25.53,14.48 31.39,20.34 32.33,20.34
USART3_RX  (via drill 0.35)
  Top 0.178: 38.38,18.36 U1.25
  Top 0.203: U1.25 38.35,16.76 37.46,15.87 v36.96,15.87
  Bottom 0.178: 71.09,17.3 71.09,11.43 BF1.8
  Bottom 0.203: 71.09,17.3 67.31,21.59 64.26,21.59 arc90 63.75,21.08 arc-90 63.37,20.7 55.63,20.7 arc90 54.61,19.68 54.61,14.48 arc-90 54.1,13.97 37.59,13.97 arc-90 36.96,14.6 v36.96,15.87
USART3_TX
  Top 0.178: 40.42,17.48 40.42,17.78 40.42,18.36 U1.29 | 57.11,2.97 57.35,2.77 58.03,2.18 61.32,2.18 62.23,3.05 62.23,4.83 63.12,5.71 64.52,5.71 66.03,3.87 BF1.5
  Top 0.203: 40.42,17.78 40.42,14.95 41.78,13.59 56.26,13.59 57.15,12.7 57.15,2.97 57.35,2.77
USART5_RX  (via drill 0.35, 0.5 pad 0.95)
  Top 0.178: 39.36,29.92 U1.54 | 46.91,36.85 PC.2
  Top 0.2: PC.2 44.32,34.16 v41.4,34.16 | v40,32.13 39.34,31.47 U1.54
  Top 0.203: v38.48,27.05 36.83,25.4 v35.56,25.4
  Bottom 0.2: v41.4,34.16 40,32.77 v40,32.13
  Bottom 0.203: v40,32.13 38.48,30.61 38.48,29.21 v38.48,27.05 | v35.56,25.4 34.67,24.51 33.75,24.51 31.59,22.35 23.08,22.35 20.16,19.43 8,19.43 7.49,18.92 HC-05.5
USART5_TX  (via drill 0.35)
  Top 0.178: U1.53 39.89,29.83 39.89,29.03 40.16,28.77 42.11,28.77 49.49,36.14 49.49,36.77 PC.1
  Top 0.203: v40.86,31.53 40.19,30.86 40.1,30.86 39.85,30.61 U1.53 | v40.64,27.18 37.59,24.13 v35.56,24.13
  Bottom 0.203: v40.86,31.53 40.64,31.31 v40.64,27.18 | v35.56,24.13 33.91,24.13 31.75,21.97 23.24,21.97 20.32,19.05 11.43,19.05 10.03,17.65 HC-05.4
USART6_RX  (via drill 0.35)
  Top 0.178: 43.8,22.81 U1.38
  Top 0.203: U1.38 42.32,22.88 41.53,22.1 41.53,21.55 42.02,21.06 42.19,21.06 42.73,20.51 42.73,14.79 43.18,14.35 53.72,14.35 54.61,15.24 54.61,17.78 arc-90 v55.88,19.05
  Bottom 0.178: 60.96,3.87 BF1.3
  Bottom 0.203: BF1.3 60.96,4.83 arc-90 62.1,5.97 63.12,5.97 arc90 67.31,10.16 67.31,13.97 arc-90 68.58,15.24 arc90 69.85,16.51 arc90 67.31,19.05 v55.88,19.05
USART6_TX  (via drill 0.35)
  Top 0.178: BF1.12 60.96,13.58
  Top 0.203: 60.96,13.58 60.96,15.24 59.69,16.51 59.69,24.13 58.55,25.27 57.75,25.27 55.09,27.94 50.45,27.94 48.93,26.42 46.99,26.42 46.35,25.78 46.35,25.02 v46.1,24.77 | U1.37 43.73,22.29 42.96,22.29 42.39,21.72 v42.29,21.72
  Bottom 0.203: v42.29,21.72 45.34,24.77 v46.1,24.77
VBAT
  Top 0.178: 32.33,27.88 U1.1
  Top 0.254: C29.2 arc-90 28.07,29.21 31.75,29.21 arc-90 32.38,28.57 U1.1
  Bottom 0.254: C29.2 27.81,30.23 22.67,35.37 22.48,35.56 22.35,35.69 VBAT.1
VCAP_1
  Top 0.178: 40.87,18.36 U1.30
  Top 0.203: U1.30 40.84,15.07 41.94,13.97 55.88,13.97 57.15,15.24 C26.1
VDD  (via drill 0.35)
  Top 0.178: 48.34,50.81 C23.1 | 53.31,50.81 C24.1 53.4,50.81 | 38.11,52.65 IC2.4 | BEAD1.1 20.69,15.25 20.32,15.25 20.16,15.25 v20.16,16.32 | U1.19 35.36,19.25 35.53,19.43 v35.53,20.77 | 41.85,18.45 U1.32 | BT0.2 26.73,34.28 31.09,29.92 34.29,29.92 U1.64 34.38,29.83 34.38,29.03 35.45,27.96 43.8,27.96 U1.48 | 26.64,39.43 I2C_MCU.5
  Top 0.203: U1.32 41.86,19.35 41.15,20.07 v39.88,20.07 | 35.6,20.83 v35.53,20.77
  Top 0.508: 53.31,50.81 48.34,50.81 | 38.11,52.65 45.14,52.65 C23.1 | 36.75,52.65 32.88,48.72 30.94,48.72 arc90 26.67,44.45 | 35.6,20.83 39.12,20.83 v39.88,20.07 | 20.32,15.25 19.55,14.48 7.62,14.48 | R2.P$1 4.45,14.48 7.62,14.48 | C27.1 7.62,14.48 | 26.67,44.45 26.67,39.46 arc-90 26.64,39.43 | PWR.2 21.59,49.53 26.67,44.45
  Top 1.27: IC2.4 36.82,52.68 arc45 36.75,52.65
  Bottom 0.178: JTAG.1 43.18,45.66 48.25,50.72 C23.1 | 26.64,39.34 I2C_MCU.5 | 26.64,34.37 BT0.2 26.73,34.28 | v20.16,16.32 20.1,17.21 22.48,19.56
  Bottom 0.203: 22.48,19.56 31.75,19.56 | 31.75,19.56 34.33,19.56 v35.53,20.77 | C28.1 31.75,19.56
  Bottom 0.508: 26.64,34.37 26.64,39.34 | 26.73,34.28 34.26,26.75 36.75,26.75 38.1,25.4 38.1,22.86 36,20.77 v35.53,20.77 | NRF.7 49.02,16 C4.1 42.04,16 41.27,16.76 41.27,18.67 v39.88,20.07
  pour Top: 27.94,54.61 45.72,54.61 45.72,50.8 48.26,48.26 48.26,46.99 45.72,49.53 35.56,49.53 34.29,48.26 34.29,46.99 29.21,46.99 27.94,45.72 27.94,38.1 21.59,38.1 21.59,45.72 22.86,46.99 25.4,46.99 26.67,48.26 26.67,53.34